# EAGLE design Lora Radio Expansion v1.0 (EAGLE 6.1)
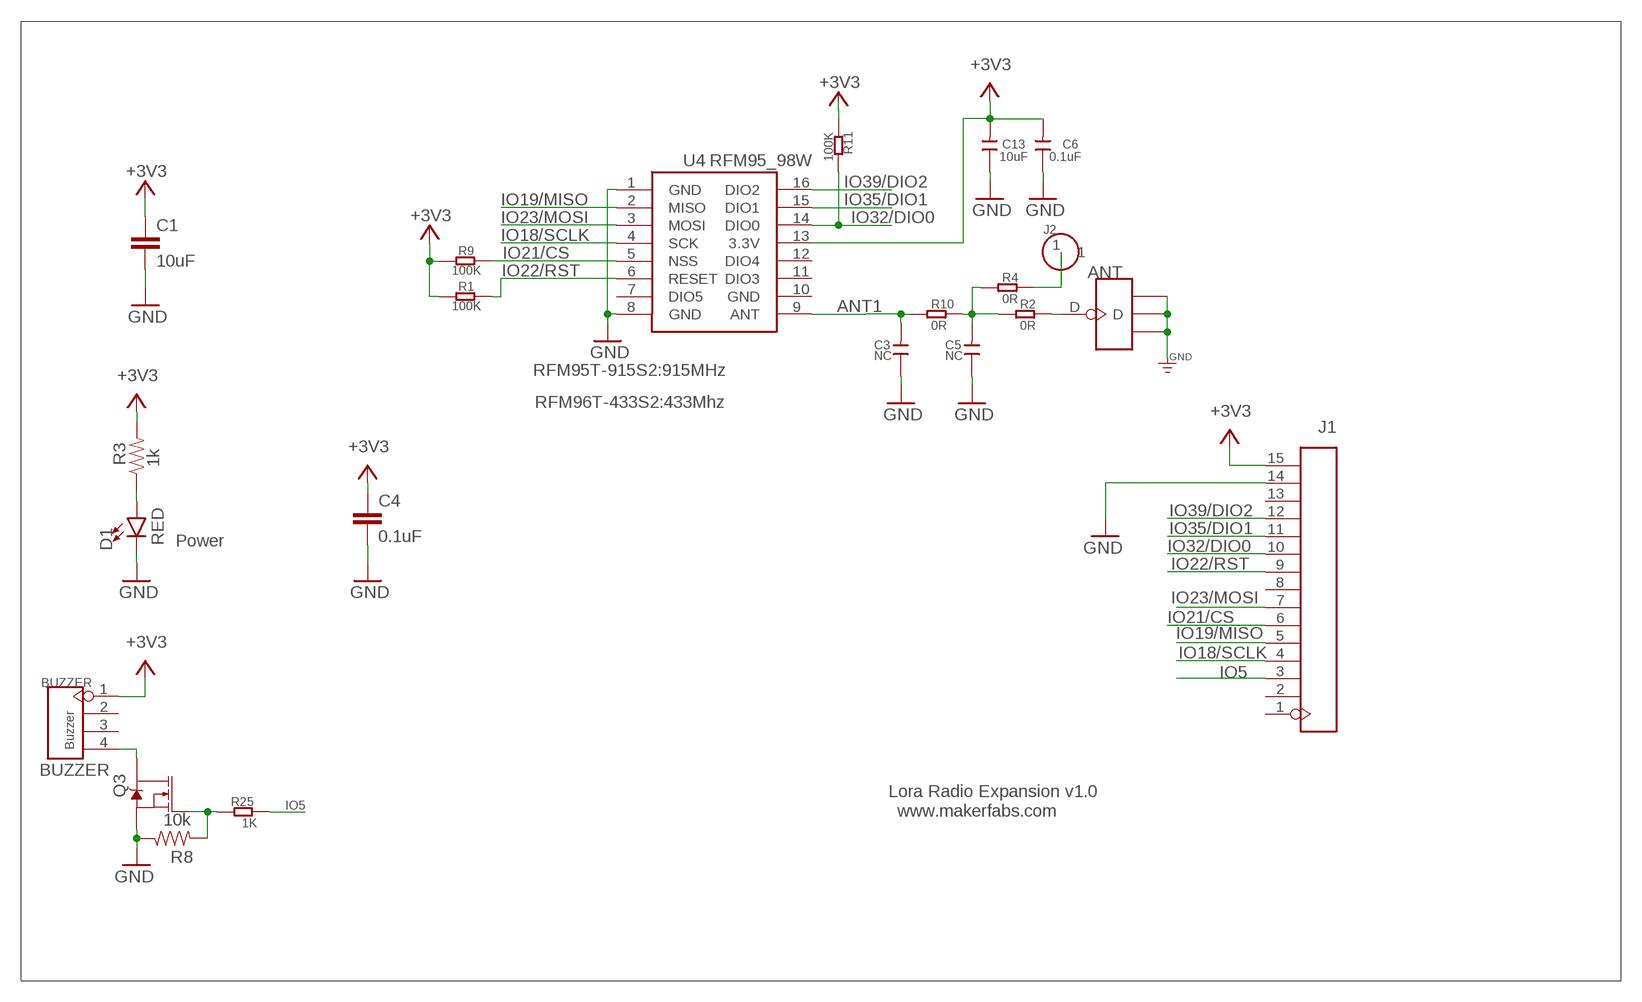
[diagram p0: schematic, sheet 1]

## Parts
ANT  ANTENNA-U-FL  [4P-U-FL]
BUZZER  Buzzer  HEADER-4P-60/35MILROUND  [4P-65/35ROUND]
C1  10uF  1.0UF-0603-16V-10%  [0603]
C3  NC  DISCRETE_C-0603  [DISCRETE_C0603]
C4  0.1uF  0.1UF-0603-25V-(+80/-20%)  [0603]
C5  NC  DISCRETE_C-0603  [DISCRETE_C0603]
C6  0.1uF  C-0603  [0603]
C13  10uF  C-0603  [0603]
D1  RED  LED-RED0603  [LED-0603]
J1  HEADER-1X15P3  [DIP-1X15-2.54MM-W]
J2  HEADER-1P-50  [1P-100/50MIL]
Q3  220mA/50V/3.5Ω  MOSFET-NCH-BSS138  [SOT23-3]
R1  100K  R-0603  [R0603]
R2  0R  DISCRETE_R-0603  [DISCRETE_R0603]
R3  1k  1KOHM-0603-1/10W-1%  [0603]
R4  0R  DISCRETE_R-0603  [DISCRETE_R0603]
R8  10k  10KOHM-0603-1/10W-1%  [0603]
R9  100K  R-0603  [R0603]
R10  0R  DISCRETE_R-0603  [DISCRETE_R0603]
R11  100K  R-0603  [R0603]
R25  1K  R-0603  [R0603]
U4  RFM95_98W  RFM92_93W  [RFM92_93W]

## Nets
+3V3: BUZZER.1 C1.1 C4.1 C6.2 C13.2 J1.15 R1.2 R3.2 R9.2 R11.2 U4.13(3.3V)
ANT1: C3.2 R10.1 U4.9(ANT)
GND: ANT.GND1 ANT.GND2 ANT.GND3 C1.2 C3.1 C4.2 C5.1 C6.1 C13.1 D1.C J1.14 Q3.2(S) R8.1 U4.1(GND) U4.8(GND)
IO5: J1.3 R25.1
IO18/SCLK: J1.4 U4.4(SCK)
IO19/MISO: J1.5 U4.2(MISO)
IO21/CS: J1.6 R9.1 U4.5(NSS)
IO22/RST: J1.9 R1.1 U4.6(RESET)
IO23/MOSI: J1.7 U4.3(MOSI)
IO32/DIO0: J1.10 R11.1 U4.14(DIO0)
IO35/DIO1: J1.11 U4.15(DIO1)
IO39/DIO2: J1.12 U4.16(DIO2)
N$1: BUZZER.4 Q3.3(D)
N$2: Q3.1(G) R8.2 R25.2
N$3: D1.A R3.1
N$4: C5.2 R2.1 R4.1 R10.2
N$5: ANT.D R2.2
N$6: J2.1 R4.2
Unconnected: BUZZER.2 BUZZER.3 J1.1 J1.2 J1.8 J1.13 U4.7(DIO5) U4.11(DIO3) U4.12(DIO4)

## Notes on the sheet
- RFM95T-915S2:915MHz
- RFM96T-433S2:433Mhz
- Power
- BUZZER
- Lora Radio Expansion v1.0
- www.makerfabs.com

## Power pins joined to a net without a drawn wire
GND: U4.10(GND)

## Library data of the parts
ANT = Connector:ANTENNA-U-FL
BUZZER = Connector:HEADER-4P
C1 = SparkFun-Capacitors:1.0UF: 1µF ceramic capacitors A capacitor is a passive two-terminal electrical component used to store electrical energy temporarily in an electric field.; PROD_ID: CAP-00868; VALUE: 1.0uF
C3 C5 = A9G:DISCRETE_C*: Ceramic Capacitors
C4 = SparkFun-Capacitors:0.1UF: 0.1µF ceramic capacitors A capacitor is a passive two-terminal electrical component used to store electrical energy temporarily in an electric field.; PROD_ID: CAP-00810
C6 C13 = Discrete:C*: Ceramic Capacitors
D1 = SparkFun-LED:LED-RED: Red SMD LED Used in manufacturing of most products at SparkFun Packages: 0603 - SMD 0603 package [Product Link] <http://docs.avagotech.com/docs/AV02-0551EN> 0603 SMART - SMD 0603 SMART package ( more efficient and expensive)[Product Link] <http://www.osram-os.com/Graphics/XPic2/00077099_0.pdf> 1206 - SMD1206 package [Product Link] <https://www.sparkfun.com/datasheets/DevTools/LilyPad/Q150OVS4.pdff> SparkFun Products: Pro Mini 328 -5V <https://www.sparkfun.com/products/821> RedBoard <https://www.sparkfun.com/products/12757> IOIO-OTG <https://www.sparkfun.com/products/13613>; PROD_ID: DIO-00819
J1 = self:HEADER-1X15P
J2 = Connector:HEADER-1P
Q3 = SparkFun-DiscreteSemi:MOSFET-NCH: N-channel MOSFETs Voltage controlled devices that allow control of high current outputs. SparkFun Products: SparkFun OpenScale <https://www.sparkfun.com/products/13261> SparkFun Digital Sandbox <https://www.sparkfun.com/products/12651> SparkFun Monster Moto Shield <https://www.sparkfun.com/products/10182> SparkFun MOSFET Power Controller <https://www.sparkfun.com/products/11214>; PROD_ID: TRANS-00830
R1 R9 R11 R25 = Discrete:R*
R2 R4 R10 = A9G:DISCRETE_R*
R3 = SparkFun-Resistors:1KOHM: 1kΩ resistor A resistor is a passive two-terminal electrical component that implements electrical resistance as a circuit element. Resistors act to reduce current flow, and, at the same time, act to lower voltage levels within circuits. - Wikipedia; PROD_ID: RES-07856
R8 = SparkFun-Resistors:10KOHM: 10kΩ resistor A resistor is a passive two-terminal electrical component that implements electrical resistance as a circuit element. Resistors act to reduce current flow, and, at the same time, act to lower voltage levels within circuits. - Wikipedia; PROD_ID: RES-00824
U4 = dragino:RFM92_93W

## Net classes
0 default: width 0.152 mm, drill 0.305 mm, clearance 0.152 mm
2 gnd: width 0.305 mm, drill 0.559 mm, clearance 0.254 mm
3 usbvcc: width 0.508 mm, drill 0.61 mm, clearance 0.254 mm

## Board
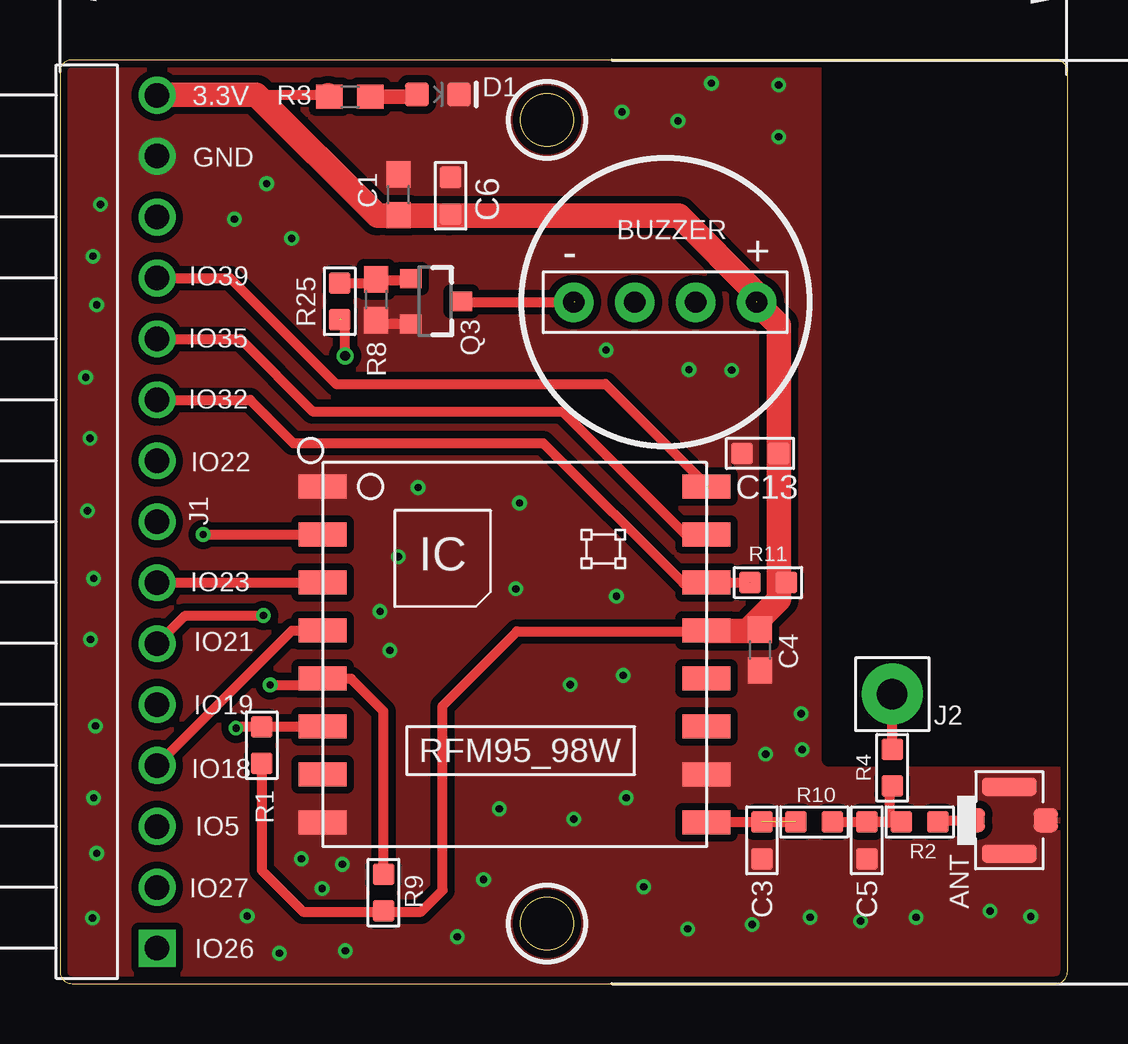
[diagram p1: board, top side]
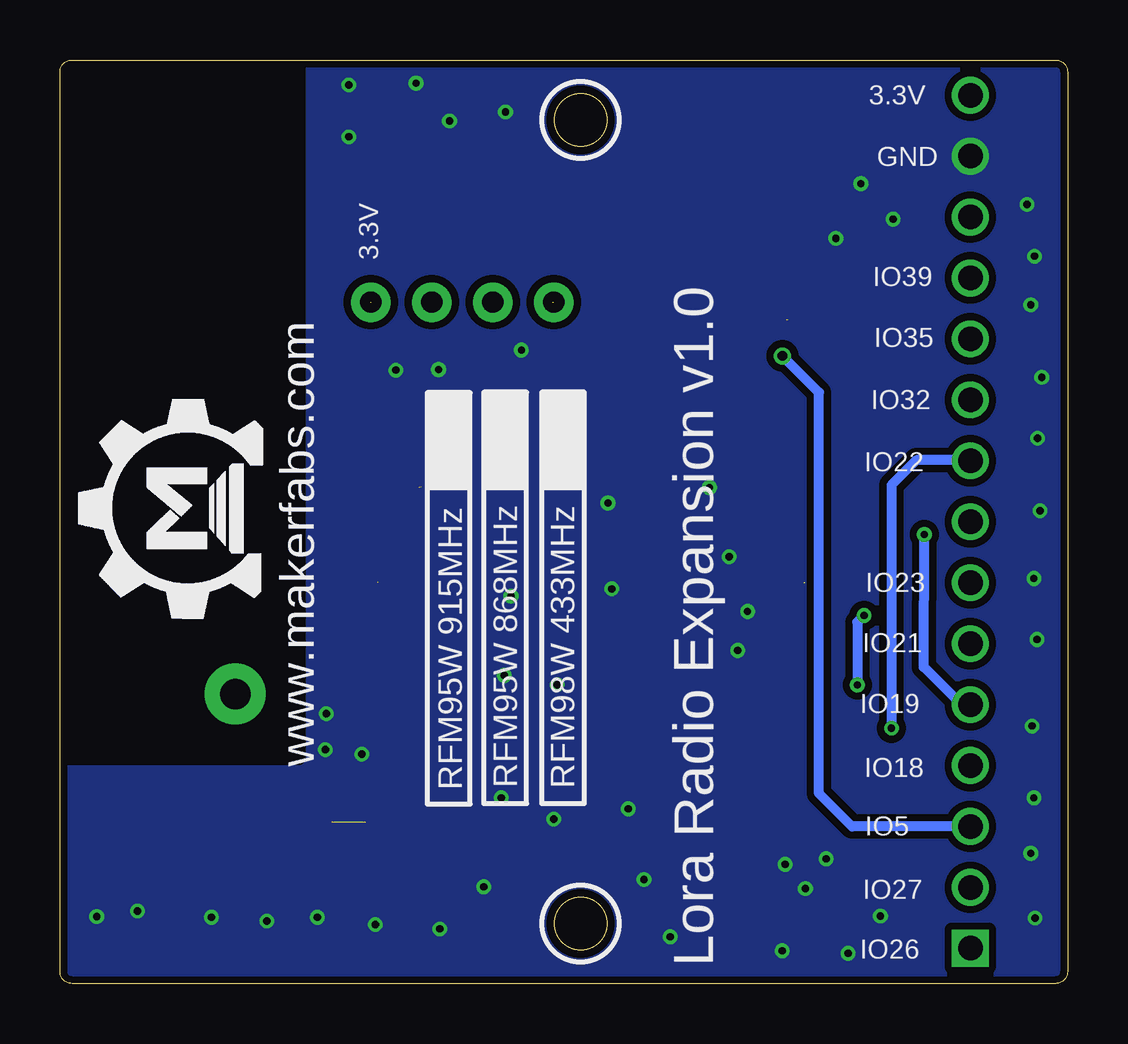
[diagram p2: board, bottom side, seen from below]

Size 42 x 38.5 mm. Coordinates in mm from the lower left corner, seen from the top.
Outline: 0,38 0,0.5 arc90 0.5,0 41.5,0 arc90 42,0.5 42,38 arc90 41.5,38.5 0.5,38.5 arc90 0,38
Outline: circle at 20.3,2.5 radius 1.1
Outline: circle at 20.3,36 radius 1.1
Copper layers (1*16): Top 0.035mm / dielectric 1.5mm / Bottom 0.035mm
Design rules: minimum track width 6mil, minimum drill 12mil, track to track 6mil, track to pad 6mil, pad to pad 6mil, via to via 6mil, smd to smd 0mil, copper to edge 10mil, drill to drill 10mil, minimum pad ring 10mil, minimum via ring 6mil, stop-mask expansion 2mil, vias tented up to drill 100mil, thermal gap 0mil
tRestrict: area 32.1,9.3 to 42,38.6
bRestrict: area 32.1,9.4 to 42,38.7

### Footprints (pad centres in the part's own frame; a part is rotated, then mirrored left to right if it is on the bottom)
4P-U-FL = smd 1.016 x 1.016: D -1.524,0; GND3 1.524,0 | smd 2.286 x 0.762: GND1 0,1.397; GND2 0,-1.397
4P-65/35ROUND = drill 0.889 pad 1.651: 1 0,3.81; 2 0,1.27; 3 0,-1.27; 4 0,-3.81
0603 = smd 1.1 x 1: 1 -0.85,0; 2 0.85,0
DISCRETE_C0603 = smd 0.889 x 0.889: 1 -0.762,0; 2 0.762,0
0603' = smd 0.889 x 0.889: 1 -0.762,0; 2 0.762,0
LED-0603 = smd 1 x 1: A -0.877,0; C 0.877,0
DIP-1X15-2.54MM-W = drill 1.02 square: 1 -17.78,0 | drill 1.02: 2 -15.24,0; 3 -12.7,0; 4 -10.16,0; 5 -7.62,0; 6 -5.08,0; 7 -2.54,0; 8 0,0; 9 2.54,0; 10 5.08,0; 11 7.62,0; 12 10.16,0; 13 12.7,0; 14 15.24,0; 15 17.78,0
1P-100/50MIL = drill 1.27 pad 2.54: 1 0,0
SOT23-3 = smd 0.8 x 0.9: 1 -0.95,-1; 2 0.95,-1; 3 0,1.1
R0603 = smd 0.889 x 0.889: 1 -0.762,0; 2 0.762,0
DISCRETE_R0603 = smd 0.889 x 0.889: 1 -0.762,0; 2 0.762,0
RFM92_93W = smd 2 x 1: 1 -8,7; 2 -8,5; 3 -8,3; 4 -8,1; 5 -8,-1; 6 -8,-3; 7 -8,-5; 8 -8,-7; 9 8,-7; 10 8,-5; 11 8,-3; 12 8,-1; 13 8,1; 14 8,3; 15 8,5; 16 8,7

### Placement (x,y rotation side)
ANT  39.57,6.81 0 top
BUZZER  25.23,28.4 270 top
C1  14.11,32.88 90 top
C3  29.26,5.97 90 top
C4  29.17,13.9 270 top
C5  33.63,5.97 90 top
C6  0.1uF  [0603']  16.28,32.84 270 top
C13  10uF  [0603']  29.18,22.1 0 top
D1  15.76,37.06 0 top
J1  4.05,19.25 90 top
J2  34.7,12.06 0 top
Q3  15.63,28.43 270 top
R1  8.41,9.93 270 top
R2  35.84,6.73 0 top
R3  12.09,36.97 180 top
R4  34.7,8.99 90 top
R8  13.19,28.5 90 top
R9  13.49,3.78 270 top
R10  31.45,6.73 0 top
R11  29.51,16.71 0 top
R25  11.66,28.44 90 top
U4  18.95,13.72 0 top
U$1  [MAKERFABS_0.3]  33.61,15.69 90 bottom

### Tracks (layer width: path | path; a pad name or v marks a point on that pad's centre or on a via)
+3V3  (1 unrouted)
  Top 0.406: R1.2 8.41,4.72 10.13,3 13.66,3 | 13.66,3 15.06,3 15.95,3.89 15.95,11.58 19.05,14.68 27,14.68 | 27,14.68 27.23,14.68 27.33,14.78 | 8.18,37.06 11.15,37.06 R3.2 | C13.2 29.97,22.1 29.97,27.46 | 29.97,16 30.28,16 R11.2 | C4.1 28.8,14.75 28.8,14.83 | 26.96,14.71 27,14.71 27,14.68 | R9.2 13.66,3.02 13.66,3 | C6.2 16.2,32.08 16.2,32 | C1.1 14.25,32.03 14.25,32
  Top 1.016: 11.18,37.03 R3.2 | U4.13 26.96,14.71 28.68,14.71 28.8,14.83 29.97,16 29.97,27.46 29.06,28.37 29.06,28.4 | BUZZER.1 29.04,28.77 25.81,32 16.2,32 14.25,32 13.23,32 8.18,37.06 4.08,37.06 J1.15
ANT1  (1 unrouted)
  Top 0.406: U4.9 26.96,6.73 R10.1
GND  (via drill 0.3)
  Top 0.406: Q3.2 13.36,27.48 R8.1
  other vias: 14.93,20.68 7.27,31.86 13.34,15.51 16.57,1.95 9.66,31.06 18.32,7.28 14.1,17.8 19.16,20.03 26.22,25.6 1.38,30.32 1.07,25.27 1.15,19.7 1.28,14.34 1.4,7.74 1.35,2.74 7.8,2.81 23.6,7.74 40.47,2.79 27.16,37.53 11.89,1.36 29.95,37.46 30.89,11.24 30.94,9.75 29.95,35.3 23.48,12.84 35.69,2.76 33.38,2.61 24.34,4.03 31.27,2.76 38.77,3.02 21.42,6.85 1.53,5.43 1.48,10.74 1.4,16.88 1.25,22.73 1.53,28.29 1.68,32.48 25.76,35.96 17.66,4.34 23.42,36.34 8.62,33.34 21.27,12.46 13.75,13.89 9.15,1.26 26.17,2.28 28.86,2.46 29.42,9.57 10.06,5.2 11.77,4.97 10.93,3.95 19,16.45 23.2,16.15 22.76,26.41 28,25.57
  pour Bottom (isolate 0.305, rank 6): -3,-1 52.07,-0.92 52.04,40 -3,40
  pour Top (isolate 0.305, rank 6): -2,-1 52.04,-1 52.04,40 -2,40
IO5  (via drill 0.41)  (1 unrouted)
  Top 0.406: v11.89,26.16 11.89,27.51 11.71,27.69
  Bottom 0.406: J1.3 8.99,6.55 10.36,7.92 10.36,24.64 v11.89,26.16
IO18/SCLK
  Top 0.406: J1.4 9.68,14.72 U4.4
IO19/MISO  (via drill 0.3)
  Top 0.406: v5.97,18.72 8.23,18.72 U4.2
  Bottom 0.406: v5.97,18.72 5.99,13.2 4.43,11.63 J1.5
IO21/CS  (via drill 0.3)
  Top 0.406: J1.6 5.22,15.34 v8.48,15.34 | v8.76,12.45 10.26,12.45 10.53,12.72 U4.5 10.95,12.7 12.14,12.7 13.49,11.35 R9.1
  Bottom 0.406: v8.48,15.34 8.76,15.06 v8.76,12.45
IO22/RST  (via drill 0.3)
  Top 0.406: v7.34,10.64 7.41,10.72 8.36,10.72 | 8.36,10.72 U4.6 | R1.1 8.36,10.69 8.36,10.72
  Bottom 0.406: J1.9 4.08,21.82 6.3,21.82 7.34,20.78 v7.34,10.64
IO23/MOSI  (1 unrouted)
  Top 0.406: J1.7 11,16.71
IO32/DIO0  (1 unrouted)
  Top 0.406: J1.10 7.93,24.33 9.73,22.53 20.14,22.53 25.98,16.69 26.92,16.69 U4.14 R11.1 28.78,16.69
IO35/DIO1
  Top 0.406: J1.11 7.52,26.87 10.54,23.85 20.95,23.85 26.06,18.75 26.92,18.75 U4.15
IO39/DIO2  (1 unrouted)
  Top 0.406: J1.12 7.09,29.41 11.51,24.99 22.73,24.99 27.03,20.7
N$1  (1 unrouted)
  Top 0.406: Q3.3 16.77,28.4 21.46,28.4
N$2
  Top 0.406: Q3.1 14.56,29.31 13.16,29.31 | 13.16,29.31 13.18,29.29 13.21,29.29 13.11,29.18 11.58,29.18 11.6,29.2 R25.2 | 13.16,29.31 R8.2
N$3
  Top 0.61: R3.1 14.79,36.97 D1.A
N$4
  Top 0.406: R10.2 C5.2 | C5.2 34.57,6.73 | 34.57,6.73 R2.1 | R4.1 34.57,8.1 34.57,6.73 | 34.57,6.73 34.54,6.71 34.52,6.73 C5.2
N$5
  Top 0.406: R2.2 36.68,6.81 ANT.D
N$6
  Top 0.406: R4.2 J2.1

### Text on the board
tPlace: 3.3V | GND | - | + | IO39 | IO35 | IO32 | IO22 | IO23 | IO21 | IO19 | IO18 | IO5 | IO27 | IO26
bPlace: 3.3V | GND | 3.3V | IO39 | IO35 | IO32 | IO22 | RFM98W 433MHz | RFM95W 868MHz | RFM95W 915MHz | IO23 | IO21 | IO19 | IO18 | www.makerfabs.com | IO5 | IO27 | IO26 | Lora Radio Expansion v1.0